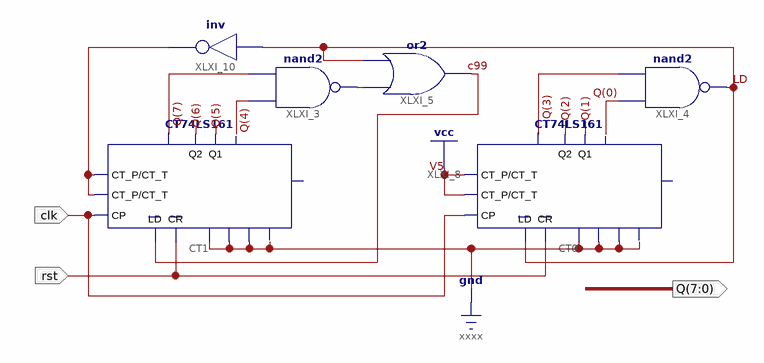
[diagram p0: schematic sheet 1]
// Xilinx ISE schematic ms_100.sch (kintex7) as structural Verilog: 6 symbols, 3 ports
module ms_100 (
  input  clk,
  input  rst,
  output [7:0] Q
);

  wire c99, LD, XLXN_7, XLXN_43;

  nand XLXI_4 (LD, Q[0], Q[3]);
  CT74LS161 #(.LD(1)) CT1 (
    .D0(1'b0), .D1(1'b0), .D2(1'b0), .D3(1'b0), .CP(clk), .LD(c99), .CR(rst), .CT_P(XLXN_43), .CT_T(XLXN_43),
    .Q0(Q[4]), .Q1(Q[5]), .Q2(Q[6]), .Q3(Q[7]));  // open: CO
  CT74LS161 CT0 (
    .D0(1'b0), .D1(1'b0), .D2(1'b0), .D3(1'b0), .CP(clk), .LD(LD), .CR(rst), .CT_P(1'b1), .CT_T(1'b1),
    .Q0(Q[0]), .Q1(Q[1]), .Q2(Q[2]), .Q3(Q[3]));  // open: CO
  or XLXI_5 (c99, XLXN_7, LD);
  nand XLXI_3 (XLXN_7, Q[4], Q[7]);
  not XLXI_10 (XLXN_43, LD);
endmodule
